# Altium project LCD_Interface.PrjPcb
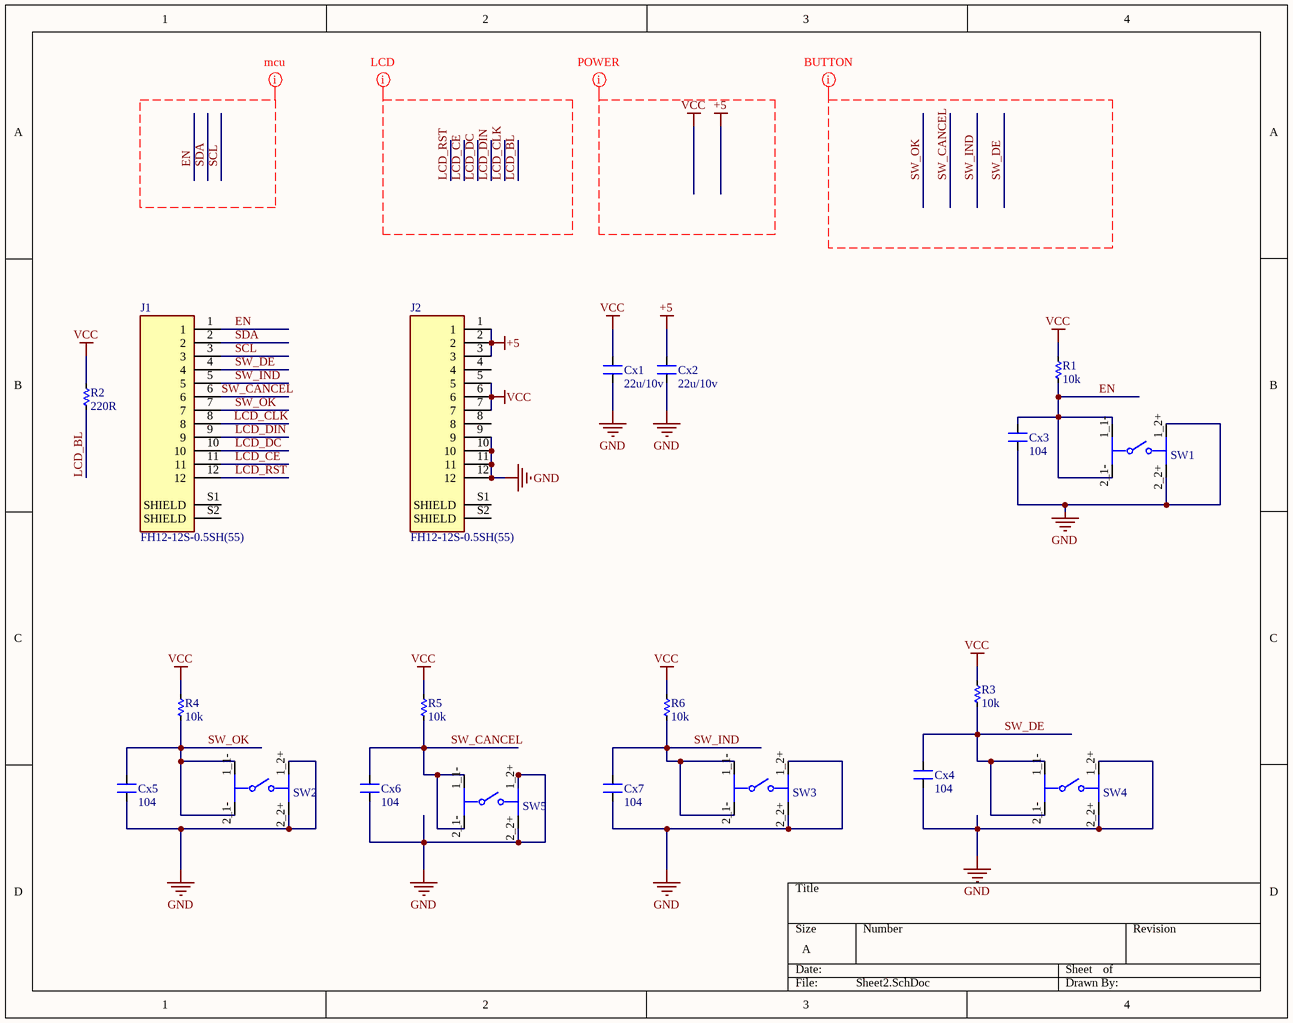
[diagram p0: Sheet2.SchDoc]
2 sheets, 28 parts. Net scope: global (net labels, ports and power ports of the same name join across sheets).
Board file: PCB2.PcbDoc
Sheets:
  Sheet2.SchDoc
  Sheet3.SchDoc

## Sheet Sheet2.SchDoc
size A

### Parts
Cx1  22u/10v  [CN-SMD-1206]
Cx2  22u/10v  [CN-SMD-1206]
Cx3  104  [CN-SMD-0603]
Cx4  104  [CN-SMD-0603]
Cx5  104  [CN-SMD-0603]
Cx6  104  [CN-SMD-0603]
Cx7  104  [CN-SMD-0603]
J1  FH12-12S-0.5SH(55)  [HIROSE_FH12-12S-0.5SH(55)]
J2  FH12-12S-0.5SH(55)  [HIROSE_FH12-12S-0.5SH(55)]
R1  10k  [RES-SMD-0603]
R2  220R  [RES-SMD-0603]
R3  10k  [RES-SMD-0603]
R4  10k  [RES-SMD-0603]
R5  10k  [RES-SMD-0603]
R6  10k  [RES-SMD-0603]
SW1  7914J-1-000  [Bourns_Inc_0_MFG]  (value not drawn)
SW2  7914J-1-000  [Bourns_Inc_0_MFG]  (value not drawn)
SW3  7914J-1-000  [Bourns_Inc_0_MFG]  (value not drawn)
SW4  7914J-1-000  [Bourns_Inc_0_MFG]  (value not drawn)
SW5  7914J-1-000  [Bourns_Inc_0_MFG]  (value not drawn)

### Nets
+5: Cx2.2 J2.1 J2.2 J2.3
GND: Cx1.1 Cx2.1 Cx3.1 Cx4.1 Cx5.1 Cx6.1 Cx7.1 J2.9 J2.10 J2.11 J2.12 SW1.1_2+(1_2+) SW1.2_2+(2_2+) SW2.1_2+(1_2+) SW2.2_2+(2_2+) SW3.1_2+(1_2+) SW3.2_2+(2_2+) SW4.1_2+(1_2+) SW4.2_2+(2_2+) SW5.1_2+(1_2+) SW5.2_2+(2_2+)
VCC: Cx1.2 J2.5 J2.6 J2.7 R1.2 R2.2 R3.2 R4.2 R5.2 R6.2
EN: Cx3.2 J1.1 R1.1 SW1.1_1-(1_1-) SW1.2_1-(2_1-)
LCD_BL: R2.1
LCD_CE: J1.11
LCD_CLK: J1.8
LCD_DC: J1.10
LCD_DIN: J1.9
LCD_RST: J1.12
SCL: J1.3
SDA: J1.2
SW_CANCEL: Cx6.2 J1.6 R5.1 SW5.1_1-(1_1-) SW5.2_1-(2_1-)
SW_DE: Cx4.2 J1.4 R3.1 SW4.1_1-(1_1-) SW4.2_1-(2_1-)
SW_IND: Cx7.2 J1.5 R6.1 SW3.1_1-(1_1-) SW3.2_1-(2_1-)
SW_OK: Cx5.2 J1.7 R4.1 SW2.1_1-(1_1-) SW2.2_1-(2_1-)

Not connected (* = marked no-connect by the designer): J1 S1(SHIELD) S2(SHIELD); J2 4 8 S1(SHIELD) S2(SHIELD)

### Layout directives
net class LCD: LCD_BL, LCD_CE, LCD_CLK, LCD_DC, LCD_DIN, LCD_RST
net class POWER: +5, VCC
net class BUTTON: SW_CANCEL, SW_DE, SW_IND, SW_OK
net class mcu: EN, SCL, SDA

### Library data of the parts
Cx1-Cx7 = CN: Value: 33pF
J1 J2 = FH12-12S-0.5SH(55): 12 Position FFC, FPC Connector Contacts, Bottom 0.020 _0.50mm_ Surface Mount, Right Angle; MF: Hirose; MP: FH12-12S-0.5SH_55_; Availability: Unavailable; Price: None; Package: None; Value: *; SnapEDA_Link: https://www.snapeda.com/parts/FH12-12S-0.5SH%2855%29/Hirose%20Electric%20Co%20Ltd/view-part/110249/?ref=snap
R1-R6 = Res-SMD: Resistor; Manufacturer: Generic Components; Class: Passive; Published: 08/06/2000; Publisher: Altium Hobart Technology Centre

## Sheet Sheet3.SchDoc
size A
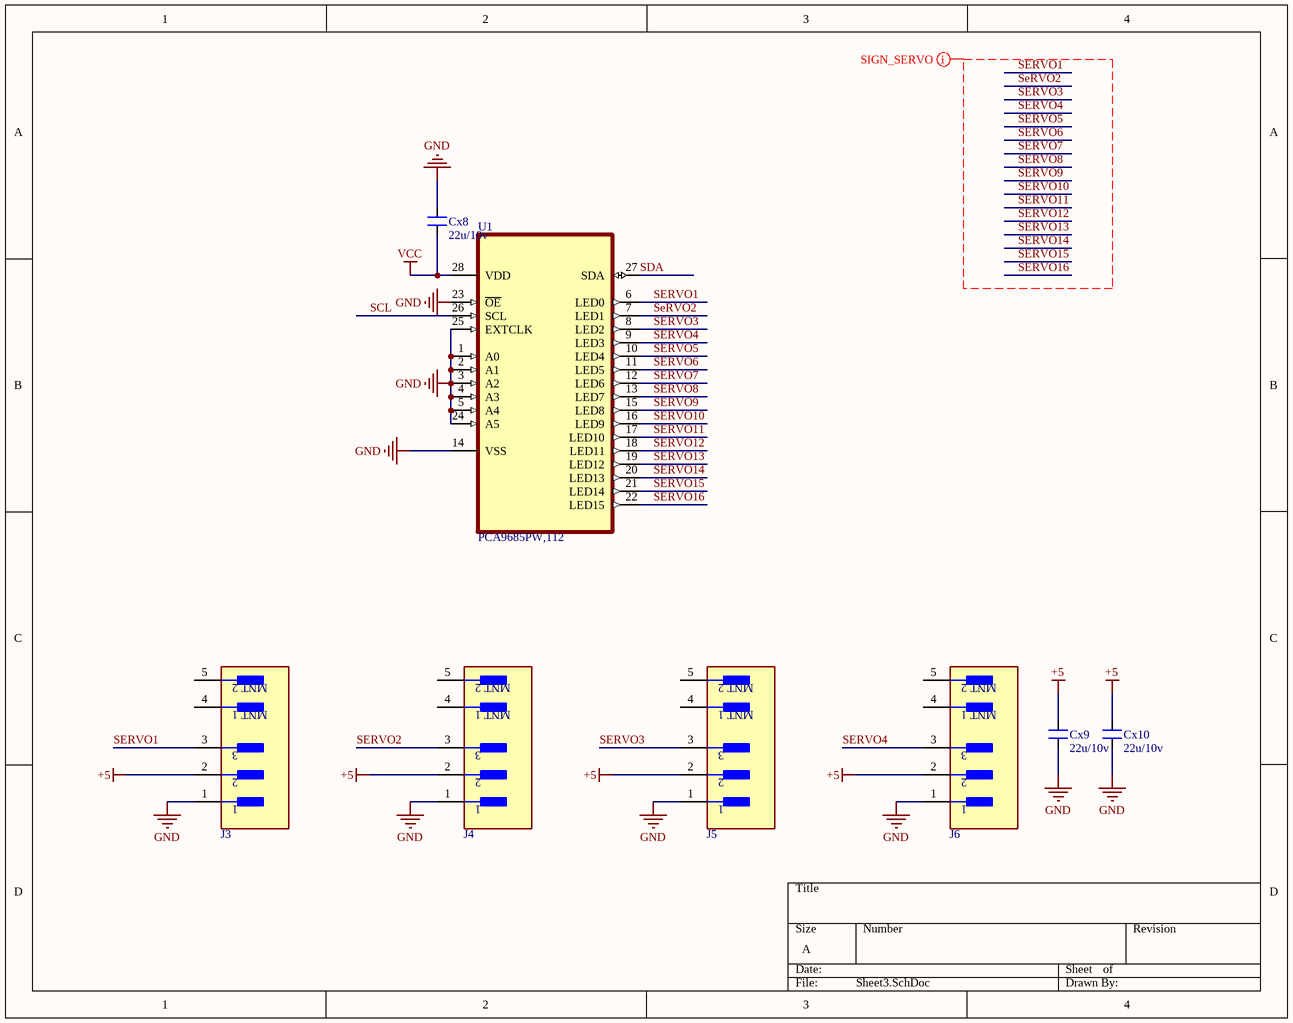
[diagram p1: Sheet3.SchDoc]

### Parts
Cx8  22u/10v  [CN-SMD-1206]
Cx9  22u/10v  [CN-SMD-1206]
Cx10  22u/10v  [CN-SMD-1206]
J3  53261-0371  [Molex_0_MFG]  (value not drawn)
J4  53261-0371  [Molex_0_MFG]  (value not drawn)
J5  53261-0371  [Molex_0_MFG]  (value not drawn)
J6  53261-0371  [Molex_0_MFG]  (value not drawn)
U1  PCA9685PW,112  [SOP65P640X110-28N]

### Nets
+5: Cx9.2 Cx10.2 J3.2 J4.2 J5.2 J6.2
GND: Cx8.2 Cx9.1 Cx10.1 J3.1 J4.1 J5.1 J6.1 U1.1(A0) U1.2(A1) U1.3(A2) U1.4(A3) U1.5(A4) U1.14(VSS) U1.23(~{OE}) U1.24(A5) U1.25(EXTCLK)
VCC: Cx8.1 U1.28(VDD)
SCL: U1.26(SCL)
SDA: U1.27(SDA)
SERVO1: J3.3 U1.6(LED0)
SeRVO2: J4.3 U1.7(LED1)
SERVO3: J5.3 U1.8(LED2)
SERVO4: J6.3 U1.9(LED3)
SERVO5: U1.10(LED4)
SERVO6: U1.11(LED5)
SERVO7: U1.12(LED6)
SERVO8: U1.13(LED7)
SERVO9: U1.15(LED8)
SERVO10: U1.16(LED9)
SERVO11: U1.17(LED10)
SERVO12: U1.18(LED11)
SERVO13: U1.19(LED12)
SERVO14: U1.20(LED13)
SERVO15: U1.21(LED14)
SERVO16: U1.22(LED15)

Not connected (* = marked no-connect by the designer): J3 4(MNT_1) 5(MNT_2); J4 4(MNT_1) 5(MNT_2); J5 4(MNT_1) 5(MNT_2); J6 4(MNT_1) 5(MNT_2)

### Layout directives
net class SIGN_SERVO: SERVO1, SeRVO2, SERVO3, SERVO4, SERVO5, SERVO6, SERVO7, SERVO8, SERVO9, SERVO10, SERVO11, SERVO12, SERVO13, SERVO14, SERVO15, SERVO16

### Library data of the parts
Cx8-Cx10 = CN: Value: 33pF
U1 = PCA9685PW,112: LED Driver IC 16 Output Linear PWM Dimming 25mA 28-TSSOP; MF: NXP USA; Purchase-URL: https://pricing.snapeda.com/search/part/PCA9685PW,112/?ref=eda; Value: *; Package: TSSOP-28 NXP Semiconductors; Digi-Key_Part_Number: 568-8366-5-ND; SnapEDA_Link: https://www.snapeda.com/parts/PCA9685PW,112/NXP%20USA%20Inc./view-part/550390/?ref=snap; MP: PCA9685PW,112; Check_prices: https://www.snapeda.com/parts/PCA9685PW,112/NXP%20USA%20Inc./view-part/550390/?ref=eda

## Nets that join several sheets
+5: Sheet2 (Cx2.2 J2.1 J2.2 J2.3), Sheet3 (6 pins)
GND: Sheet2 (21 pins), Sheet3 (16 pins)
VCC: Sheet2 (10 pins), Sheet3 (Cx8.1 U1.28)
SCL: Sheet2 (J1.3), Sheet3 (U1.26)
SDA: Sheet2 (J1.2), Sheet3 (U1.27)